# Altium schematic sheet Sheet1.SchDoc
size A; SheetNumber: 2; SheetTotal: 2
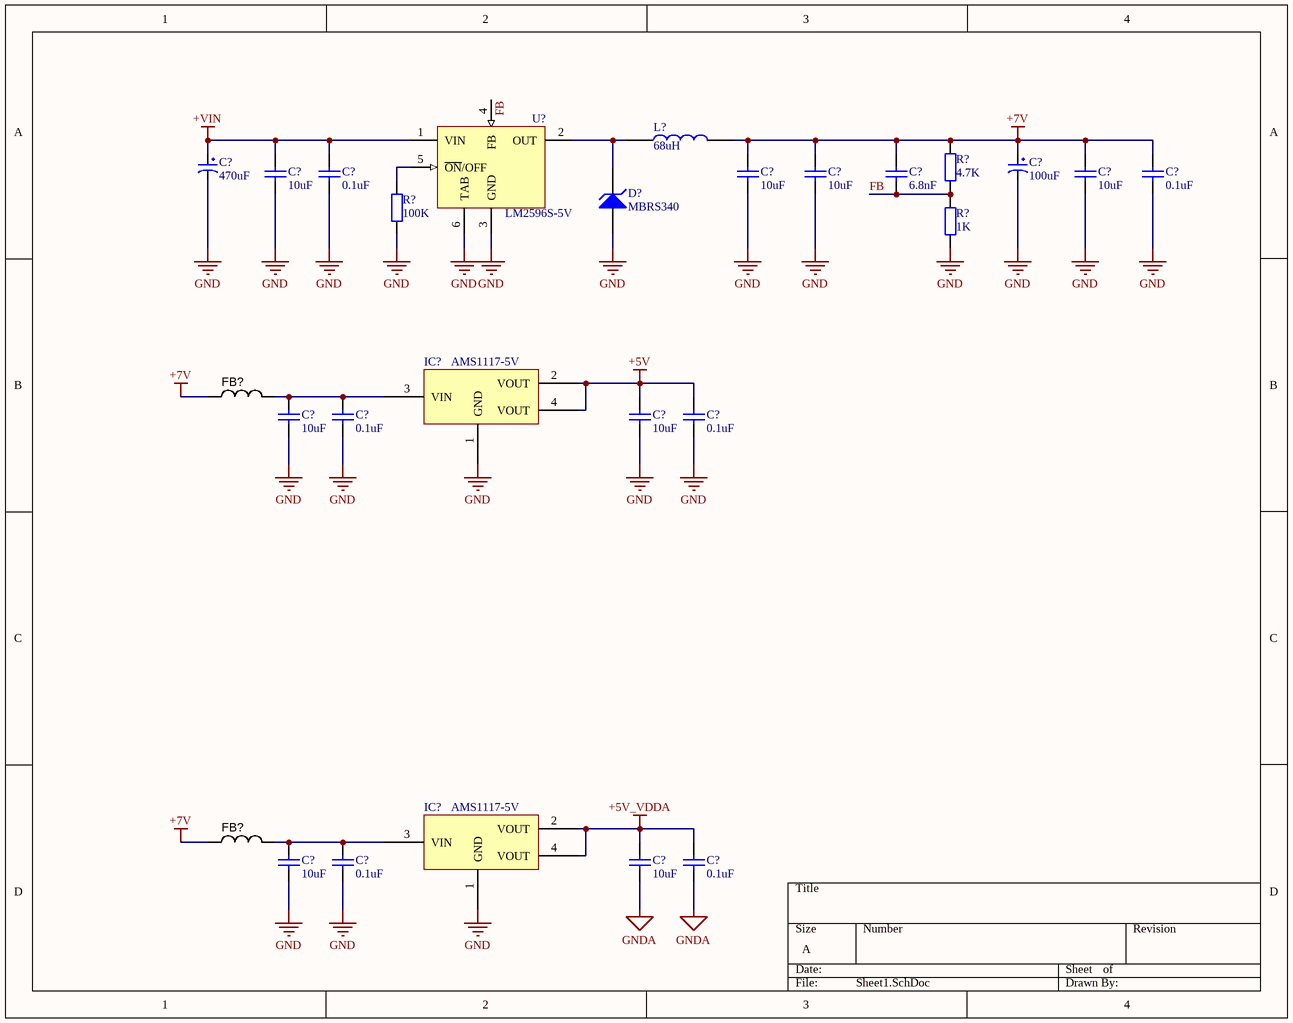
[diagram p0: Sheet1.SchDoc]

## Parts
(Parts that share a designator on the sheet are numbered #1, #2 ... from top to bottom, then left to right.)
C?#1  10uF  [CAP_CERAMIC_0805(2012mm)]
C?#2  0.1uF  [CAP_CERAMIC_0805(2012mm)]
C?#3  10uF  [CAP_CERAMIC_0805(2012mm)]
C?#4  10uF  [CAP_CERAMIC_0805(2012mm)]
C?#5  6.8nF  [CAP_CERAMIC_0805(2012mm)]
C?#6  10uF  [CAP_CERAMIC_0805(2012mm)]
C?#7  0.1uF  [CAP_CERAMIC_0805(2012mm)]
C?#8  470uF  [tu tantalum smd7343]
C?#9  100uF  [tu tantalum smd7343]
C?#10  10uF  [CAP_CERAMIC_0805(2012mm)]
C?#11  0.1uF  [CAP_CERAMIC_0805(2012mm)]
C?#12  10uF  [CAP_CERAMIC_0805(2012mm)]
C?#13  0.1uF  [CAP_CERAMIC_0805(2012mm)]
C?#14  10uF  [CAP_CERAMIC_0805(2012mm)]
C?#15  0.1uF  [CAP_CERAMIC_0805(2012mm)]
C?#16  10uF  [CAP_CERAMIC_0805(2012mm)]
C?#17  0.1uF  [CAP_CERAMIC_0805(2012mm)]
D?  MBRS340  [DIODE_DO214AB_SMC]
FB?#1  (no value)  [FBC2012N]
FB?#2  (no value)  [FBC2012N]
IC?#1  AMS1117-5V  [SOT223]
IC?#2  AMS1117-5V  [SOT223]
L?  68uH  [Cuon Cam 12x12x10]
R?#1  4.7K  [RESC-0805 (2012)]
R?#2  100K  [RESC-0805 (2012)]
R?#3  1K  [RESC-0805 (2012)]
U?  LM2596S-5V  [TO263-5]

## Nets
+5V: C?#12.1 C?#13.1 IC?#1.2(VOUT) IC?#1.4(VOUT)
+5V_VDDA: C?#16.1 C?#17.1 IC?#2.2(VOUT) IC?#2.4(VOUT)
+7V: C?#3.1 C?#4.1 C?#5.1 C?#6.1 C?#7.1 C?#9.1 FB?#1.1 FB?#2.1 L?.2 R?#1.1
+VIN: C?#1.1 C?#2.1 C?#8.1 U?.1(VIN)
GND: C?#1.2 C?#2.2 C?#3.2 C?#4.2 C?#6.2 C?#7.2 C?#8.2 C?#9.2 C?#10.2 C?#11.2 C?#12.2 C?#13.2 C?#14.2 C?#15.2 D?.1(A) IC?#1.1(GND) IC?#2.1(GND) R?#2.2 R?#3.2 U?.3(GND) U?.6(TAB)
GNDA: C?#16.2 C?#17.2
FB: C?#5.2 R?#1.2 R?#3.1 U?.4(FB)
NetC?#10_1: C?#10.1 C?#11.1 FB?#1.2 IC?#1.3(VIN)
NetC?#14_1: C?#14.1 C?#15.1 FB?#2.2 IC?#2.3(VIN)
NetD?_2: D?.2(K) L?.1 U?.2(OUT)
NetR?#2_1: R?#2.1 U?.5(~{ON}/OFF)

## Library data of the parts
C?#1-C?#7 C?#10-C?#17 = C0805(2012): Capacitor SMD 0805(2012); Value: 33p; Published: 8-Jun-2000; LatestRevisionDate: 17-Jul-2002; LatestRevisionNote: Re-released for DXP Platform.; PackageReference: RAD-0.3; Publisher: Altium Limited
C?#8 C?#9 = Tu tantalum 470uF 10V SMD7343: Dán; Don_Vi: Con; So_Chan: 2; Ten_Linh_Kien: Tụ tantalum 477A-470uF 10V SMD7343; Ma_Hang: MH001956; Chung_Loai: Dán; Kieu_Chan: *
D? = SMCJ48CA: TVS DIODE 48V 77.4V DO214AB; MFR: Littelfuse Inc.; Solder: SMT; Value: SMCJ48CA; MPN: SMCJ48CA; PinCount: 2
FB?#1 FB?#2 = FERRITE_2K2-100MHz_0805: Ferrite bead 2.2K Ohm at 100 MHz 200mA 0805 SMD; Manufacturer 1: Laird-Signal Integrity Products; Ratings: 200 mA; 800 mOhm DC; Impedance @ Frequency: 600 Ohm @ 100MHz; DC Resistance (DCR): 800 mOhm Max; Filter Type: Differential Mode - Single; SCDType: source; Size / Dimension: 0.063" L x 0.031" W (1.60mm x 0.80mm); Current Rating: 200mA; Package / Case: 0805 (2012 Metric); Height (Max): 0.043" (1.09mm); ComponentLink1URL: http://www.lairdtech.com/WorkArea/linkit.aspx?LinkIdentifier=id&ItemID=4879; ComponentLink1Description: http://www.lairdtech.com/WorkArea/linkit.aspx?LinkIdentifier=id&ItemID=4879; Supplier 1: Digi-Key; Supplier Part Number 1: 240-2562-1-ND; Mounting Type: Surface Mount
IC?#1 IC?#2 = AMS1117 SMD: Dán; Value: AMS1117-3.3V SOT223; Don_Vi: Con; Ma_Hang: MH000596; Ghi_Chu: *; Kieu_Chan: *; Chung_Loai: Dán
L? = CUON CAM 100uH SMD: Dán; Don_Vi: Con; Ma_Hang: MH003999; Ten_Linh_Kien: Cuộn Cảm 100uH 7x7x4MM CD74; Ma_Hang: *; Kieu_Chan: *; Chung_Loai: Dán
R?#1-R?#3 = RC0805FR-07100KL: RES SMD 100K OHM 1% 1/8W 0805; Solder: SMT; CompanyID: VT-00006; Value: 100K; MPN: RC0805FR-07100KL; Category: RESISTOR
U? = LM2596S-ADJ: SIMPLE SWITCHER Power Converter 150 KHz 3A Step-Down Voltage Regulator; MPN: LM2596SX-ADJ/NOPB; Solder: SMT; Value: LM2596S-ADJ; Category: IC